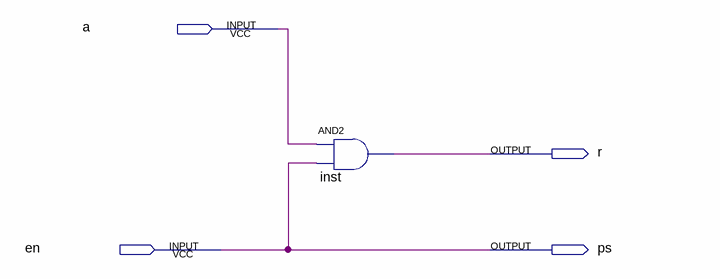
[diagram p0: schematic sheet]
// Quartus schematic decoder_half.bdf as structural Verilog: 1 symbols, 4 pins
module decoder_half (
  input  a,
  input  en,
  output r,
  output ps
);

  and inst (r, a, en);

  assign ps = en;
endmodule
